# Altium schematic sheet CAN_5V.SchDoc
size A
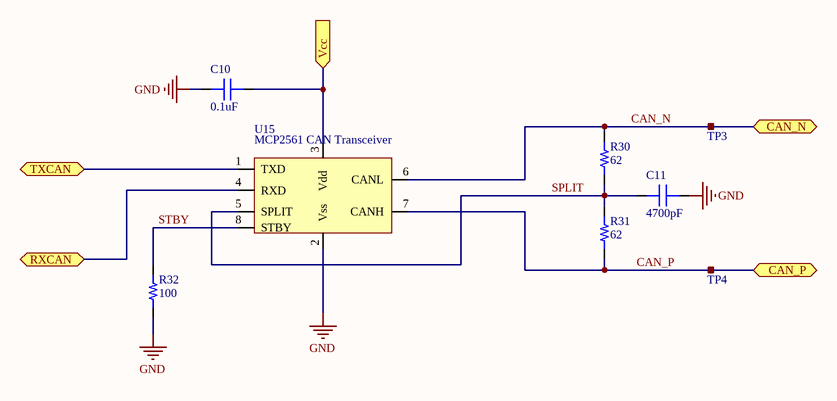
[diagram p0: CAN_5V.SchDoc]

## Parts
C10  capacitance: 0.1uF  [0603]  (hidden comment: capacitor)
C11  capacitance: 4700pF  [0603]  (hidden comment: capacitor)
R30  resistance: 62  [0603]  (hidden comment: resistor)
R31  resistance: 62  [0603]  (hidden comment: resistor)
R32  resistance: 100  [0603]  (hidden comment: resistor)
TP3  RCU-0C  [RCU-0C]  (value not drawn)
TP4  RCU-0C  [RCU-0C]  (value not drawn)
U15  MCP2561 CAN Transceiver  [SOIC-8]

## Ports
CAN_N (bidir), CAN_P (bidir), RXCAN (bidir), TXCAN (bidir), Vcc (in)

## Nets
GND: C10.1 C11.2 R32.2 U15.2(Vss)
CAN_N: R30.1 TP3.1 U15.6(CANL) ; port CAN_N
CAN_P: R31.2 TP4.1 U15.7(CANH) ; port CAN_P
RXCAN: U15.4(RXD) ; port RXCAN
SPLIT: C11.1 R30.2 R31.1 U15.5(SPLIT)
STBY: R32.1 U15.8(STBY)
TXCAN: U15.1(TXD) ; port TXCAN
Vcc: C10.2 U15.3(Vdd) ; port Vcc

## Library data of the parts
C10 C11 = 1: Generic 0603 capacitor; id: 1; voltage: 50; dielectric: Ceramic; percent tolerance: 10; name: 0603 Capacitor; ESR: 1; package: 0603; quantity: 0
R30-R32 = 1: id: 1; name: 0603 Resistor; percent tolerance: 5; package: 0603; quantity: 0
TP3 TP4 = 14: id: 14; numcontacts: 1; name: RCU-0C; numrows: 1; quantity: 0; link: https://www.digikey.com/product-detail/en/te-connectivity-amp-connectors/RCU-0C/A106145CT-ND/3477802
U15 = 5: id: 5; name: null; vcc: 0; type: CAN; package: SOIC-8; quantity: 0; link: https://www.digikey.com/product-detail/en/microchip-technology/MCP2561T-E-SN/MCP2561T-E-SNCT-ND/5148846